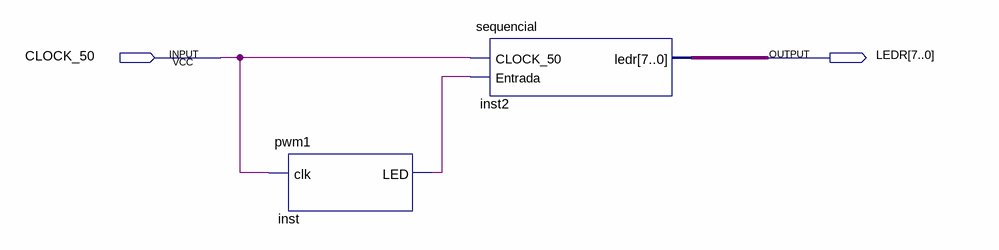
[diagram p0: schematic sheet]
// Quartus schematic exercicio.bdf as structural Verilog: 2 symbols, 2 pins
module exercicio (
  input  CLOCK_50,
  output [7:0] LEDR
);

  wire inst_led;

  pwm1 inst (.clk(CLOCK_50), .LED(inst_led));
  sequencial inst2 (.CLOCK_50(CLOCK_50), .Entrada(inst_led), .ledr(LEDR));
endmodule
